# EAGLE design thermostat1 (EAGLE 6.5.0)
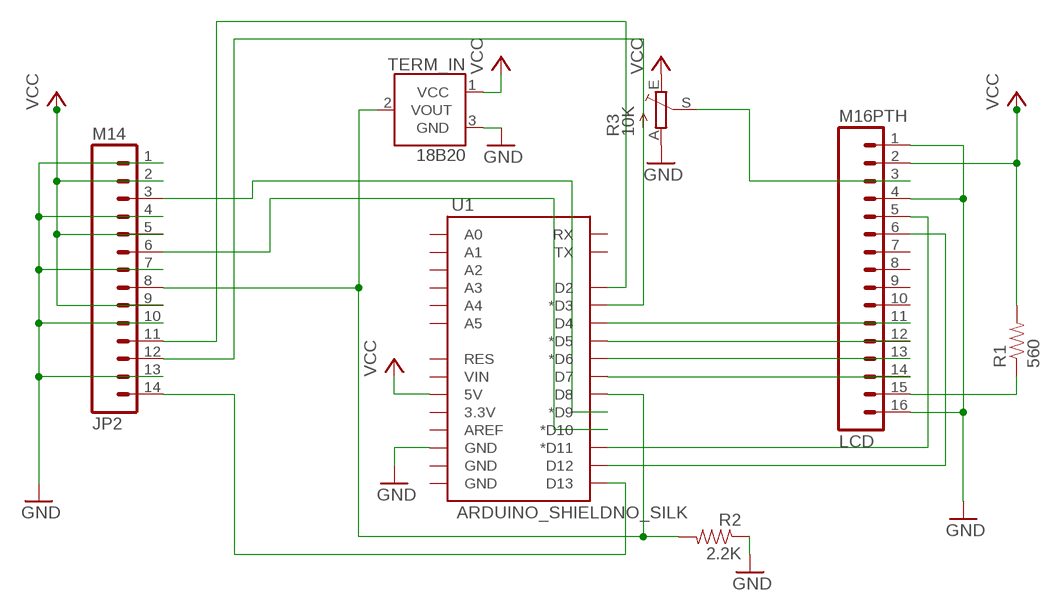
[diagram p0: schematic, sheet 1]

## Parts
JP2  M14  [1X14]
LCD  M16PTH  [1X16]
R1  560  RESISTORPTH-1/2W  [AXIAL-0.5]
R2  2.2K  RESISTORPTH-1/2W  [AXIAL-0.5]
R3  10K  TRIM_EU-CA6V  [CA6V]
TERM_IN  18B20  TMP36GT9  [TO-92]
U1  ARDUINO_SHIELDNO_SILK  [DUEMILANOVE_VIAS]

## Nets
GND: JP2.1 JP2.4 JP2.7 JP2.10 JP2.13 LCD.1 LCD.4 LCD.16 R2.P$1 R3.A TERM_IN.3(GND) U1.GND@2(GND)
N$1: LCD.3 R3.S
N$2: LCD.14 U1.D7
N$3: LCD.13 U1.D6(*D6)
N$4: LCD.15 R1.P$1
N$5: LCD.6 U1.D12
N$6: LCD.5 U1.D11(*D11)
N$7: LCD.12 U1.D5(*D5)
N$8: LCD.11 U1.D4
N$12: JP2.3 U1.D9(*D9)
N$13: JP2.6 U1.D10(*D10)
N$14: JP2.11 U1.D2
N$15: JP2.12 U1.D3(*D3)
N$16: JP2.14 U1.D13
N$17: JP2.8 R2.P$2 TERM_IN.2(VOUT) U1.D8
VCC: JP2.2 JP2.5 JP2.9 LCD.2 R1.P$2 R3.E TERM_IN.1(VCC) U1.5V
Unconnected: LCD.7 LCD.8 LCD.9 LCD.10 U1.3.3V U1.A0 U1.A1 U1.A2 U1.A3 U1.A4 U1.A5 U1.AREF U1.GND@0(GND) U1.GND@1(GND) U1.RES U1.RX U1.TX U1.VIN

## Library data of the parts
JP2 = SparkFun-Connectors:M14: Header 14 Standard 14-pin 0.1" header. Use with straight break away headers (SKU : PRT-00116), right angle break away headers (PRT-00553), swiss pins (PRT-00743), machine pins (PRT-00117), and female headers (PRT-00115).
LCD = SparkFun-Connectors:M16: 1x16 .1" header
R1 R2 = SparkFun-Resistors:RESISTOR: Resistor Basic schematic elements and footprints for 0603, 1206, and PTH resistors.
R3 = pot:TRIM_EU-: POTENTIOMETER
TERM_IN = SparkFun-Sensors:TMP36: Precision degC temp sensor, analog out
U1 = SparkFun-Boards:ARDUINO_SHIELD: Arduino shield footprint

## Board
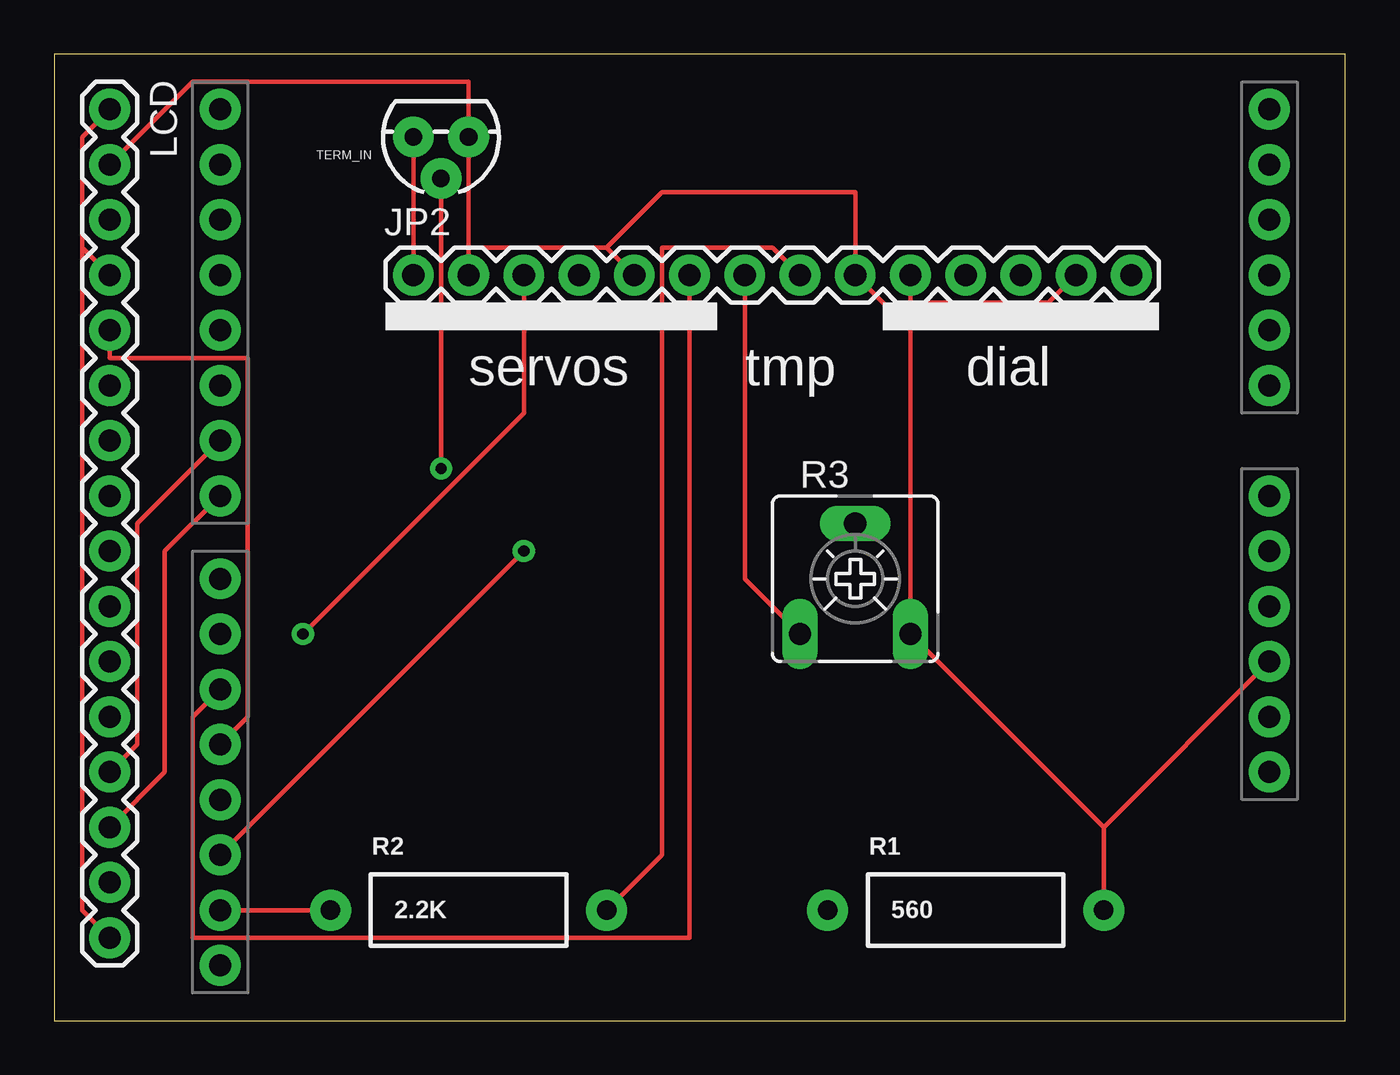
[diagram p1: board, top side]
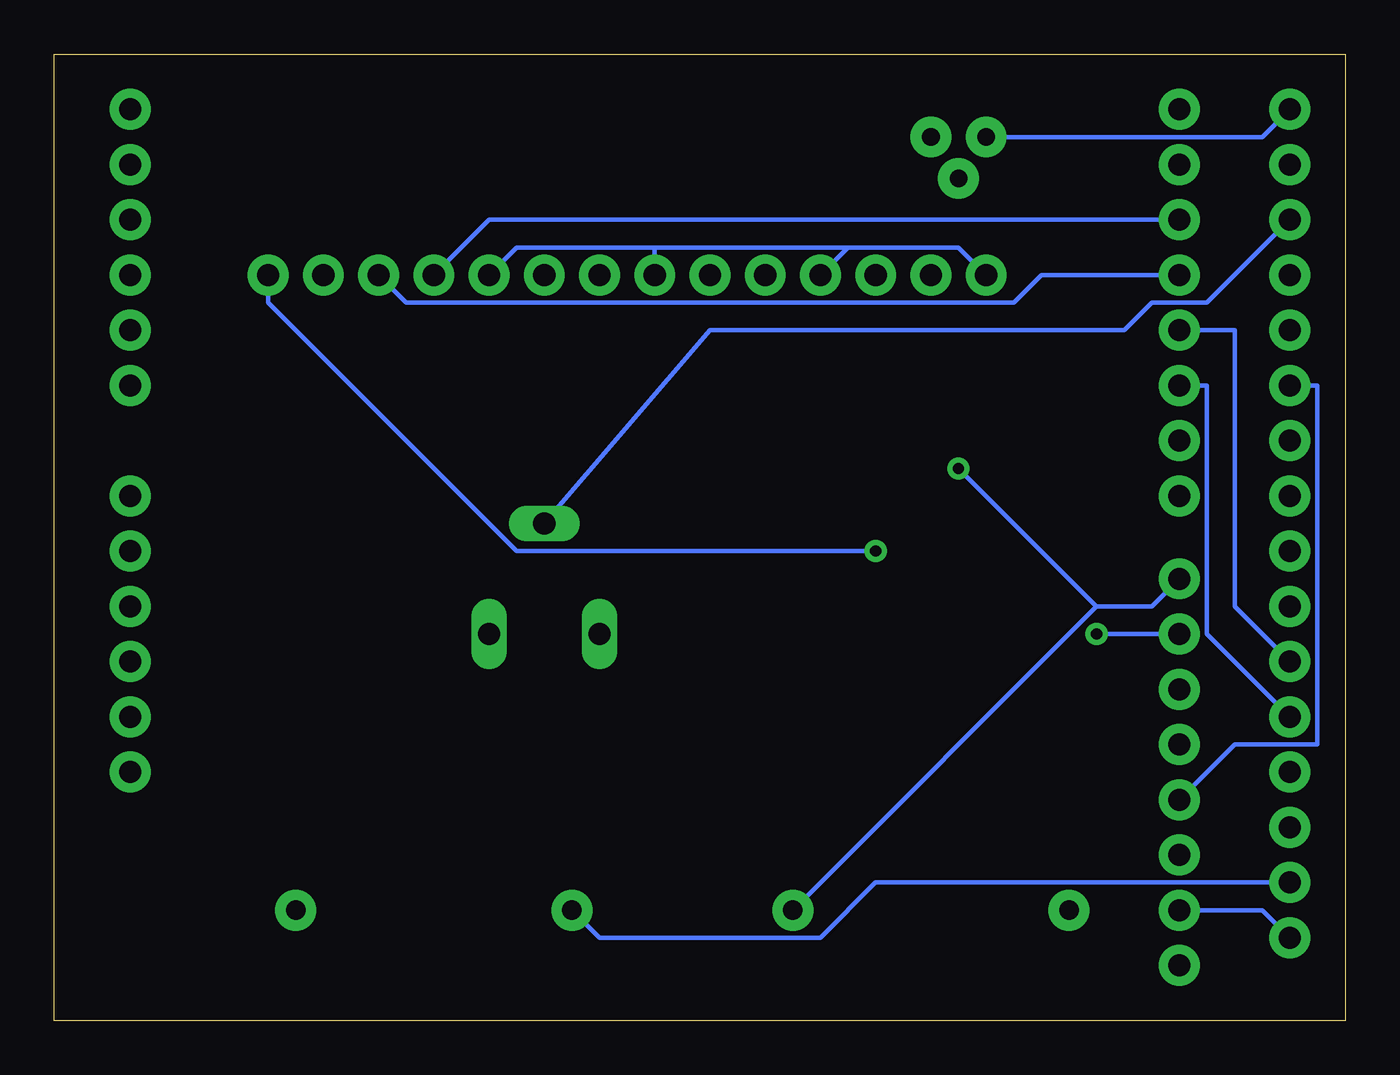
[diagram p2: board, bottom side, seen from below]

Size 59.36 x 44.44 mm. Coordinates in mm from the lower left corner, seen from the top.
Outline: 0,0 59.36,0 59.36,44.44 0,44.44 0,0
Copper layers (1*16): Top 0.035mm / dielectric 1.5mm / Bottom 0.035mm
Design rules "SparkFun": minimum track width 8mil, minimum drill 20mil, track to track 8mil, track to pad 8mil, pad to pad 8mil, via to via 8mil, smd to smd 8mil, copper to edge 10mil, drill to drill 8mil, minimum pad ring 12mil, minimum via ring 10mil, stop-mask expansion 4mil, vias tented up to drill 25mil, thermal gap 10mil

### Footprints (pad centres in the part's own frame; a part is rotated, then mirrored left to right if it is on the bottom)
1X14 = drill 1.016 pad 1.88: 1 0,0; 2 2.54,0; 3 5.08,0; 4 7.62,0; 5 10.16,0; 6 12.7,0; 7 15.24,0; 8 17.78,0; 9 20.32,0; 10 22.86,0; 11 25.4,0; 12 27.94,0; 13 30.48,0; 14 33.02,0
1X16 = drill 1.016 pad 1.88: 1 0,0; 2 2.54,0; 3 5.08,0; 4 7.62,0; 5 10.16,0; 6 12.7,0; 7 15.24,0; 8 17.78,0; 9 20.32,0; 10 22.86,0; 11 25.4,0; 12 27.94,0; 13 30.48,0; 14 33.02,0; 15 35.56,0; 16 38.1,0
AXIAL-0.5 = drill 0.9 pad 1.88: P$1 -6.35,0; P$2 6.35,0
CA6V = drill 1.016 long: A -2.54,-2.54; E 2.54,-2.54; S 0,2.54
TO-92 = drill 0.813 pad 1.88: 1 -1.27,0; 2 0,1.905; 3 1.27,0
DUEMILANOVE_VIAS = drill 1.016 pad 1.88: 3.3V 50.8,13.97; 5V 50.8,16.51; A0 50.8,29.21; A1 50.8,31.75; A2 50.8,34.29; A3 50.8,36.83; A4 50.8,39.37; A5 50.8,41.91; AREF 2.54,2.54; D2 2.54,36.83; D3 2.54,34.29; D4 2.54,31.75; D5 2.54,29.21; D6 2.54,26.67; D7 2.54,24.13; D8 2.54,20.32; D9 2.54,17.78; D10 2.54,15.24; D11 2.54,12.7; D12 2.54,10.16; D13 2.54,7.62; GND@0 50.8,19.05; GND@1 50.8,21.59; GND@2 2.54,5.08; RES 50.8,11.43; RX 2.54,41.91; TX 2.54,39.37; VIN 50.8,24.13

### Placement (x,y rotation side)
JP2  16.51,34.29 0 top
LCD  2.54,41.91 270 top
R1  41.91,5.08 0 top
R2  19.05,5.08 0 top
R3  36.83,20.32 0 top
TERM_IN  17.78,40.64 180 top
U1  5.08,0 0 top

### Tracks (layer width: path | path; a pad name or v marks a point on that pad's centre or on a via)
GND
  Top 0.203: R3.A 31.75,20.32 JP2.7 | U1.GND@2 R2.P$1 | 1.27,35.56 LCD.4 | 1.27,35.56 1.27,40.64 LCD.1 | TERM_IN.3 JP2.1 | JP2.13 45.72,33.02 39.37,33.02 JP2.10 | LCD.16 1.27,5.08 1.27,35.56
  Bottom 0.203: LCD.16 3.81,5.08 U1.GND@2 | 22.86,35.56 JP2.4 | 22.86,35.56 17.78,35.56 JP2.1 | JP2.10 38.1,35.56 31.75,35.56 | 22.86,35.56 31.75,35.56 | LCD.1 3.81,40.64 TERM_IN.3 | 31.75,35.56 JP2.7
N$1
  Bottom 0.203: R3.S 29.21,31.75 10.16,31.75 8.89,33.02 6.35,33.02 LCD.3
N$2
  Top 0.203: LCD.14 5.08,11.43 5.08,21.59 U1.D7
N$3
  Top 0.203: LCD.13 3.81,12.7 3.81,22.86 U1.D6
N$4
  Bottom 0.203: LCD.15 21.59,6.35 24.13,3.81 34.29,3.81 R1.P$1
N$5
  Bottom 0.203: U1.D12 5.08,12.7 1.27,12.7 1.27,29.21 LCD.6
N$6
  Top 0.203: U1.D11 8.89,13.97 8.89,30.48 2.54,30.48 LCD.5
N$7
  Bottom 0.203: LCD.12 6.35,17.78 6.35,29.21 U1.D5
N$8
  Bottom 0.203: LCD.11 5.08,19.05 5.08,31.75 U1.D4
N$12  (via drill 0.51)
  Top 0.203: v11.43,17.78 21.59,27.94 JP2.3
  Bottom 0.203: v11.43,17.78 U1.D9
N$13
  Top 0.203: U1.D10 6.35,13.97 6.35,3.81 29.21,3.81 JP2.6
N$14
  Bottom 0.203: U1.D2 39.37,36.83 JP2.11
N$15
  Bottom 0.203: U1.D3 13.97,34.29 15.24,33.02 43.18,33.02 JP2.12
N$16  (via drill 0.51)
  Top 0.203: v21.59,21.59 U1.D13
  Bottom 0.203: v21.59,21.59 38.1,21.59 49.53,33.02 JP2.14
N$17  (via drill 0.51)
  Top 0.203: JP2.8 33.02,35.56 27.94,35.56 27.94,7.62 R2.P$2 | v17.78,25.4 TERM_IN.2
  Bottom 0.203: U1.D8 8.89,19.05 11.43,19.05 | R2.P$2 11.43,19.05 | 11.43,19.05 v17.78,25.4
VCC
  Top 0.203: 19.05,35.56 TERM_IN.1 19.05,43.18 6.35,43.18 LCD.2 | 19.05,35.56 JP2.2 | 25.4,35.56 JP2.5 | 19.05,35.56 25.4,35.56 | 48.26,8.89 R3.E 39.37,31.75 JP2.9 36.83,38.1 27.94,38.1 25.4,35.56 | R1.P$2 48.26,8.89 | 48.26,8.89 U1.5V

### Text on the board
tPlace: servos | tmp | dial